# EAGLE schematic rgbsaber_periph1_v1.6 (EAGLE 5.10)
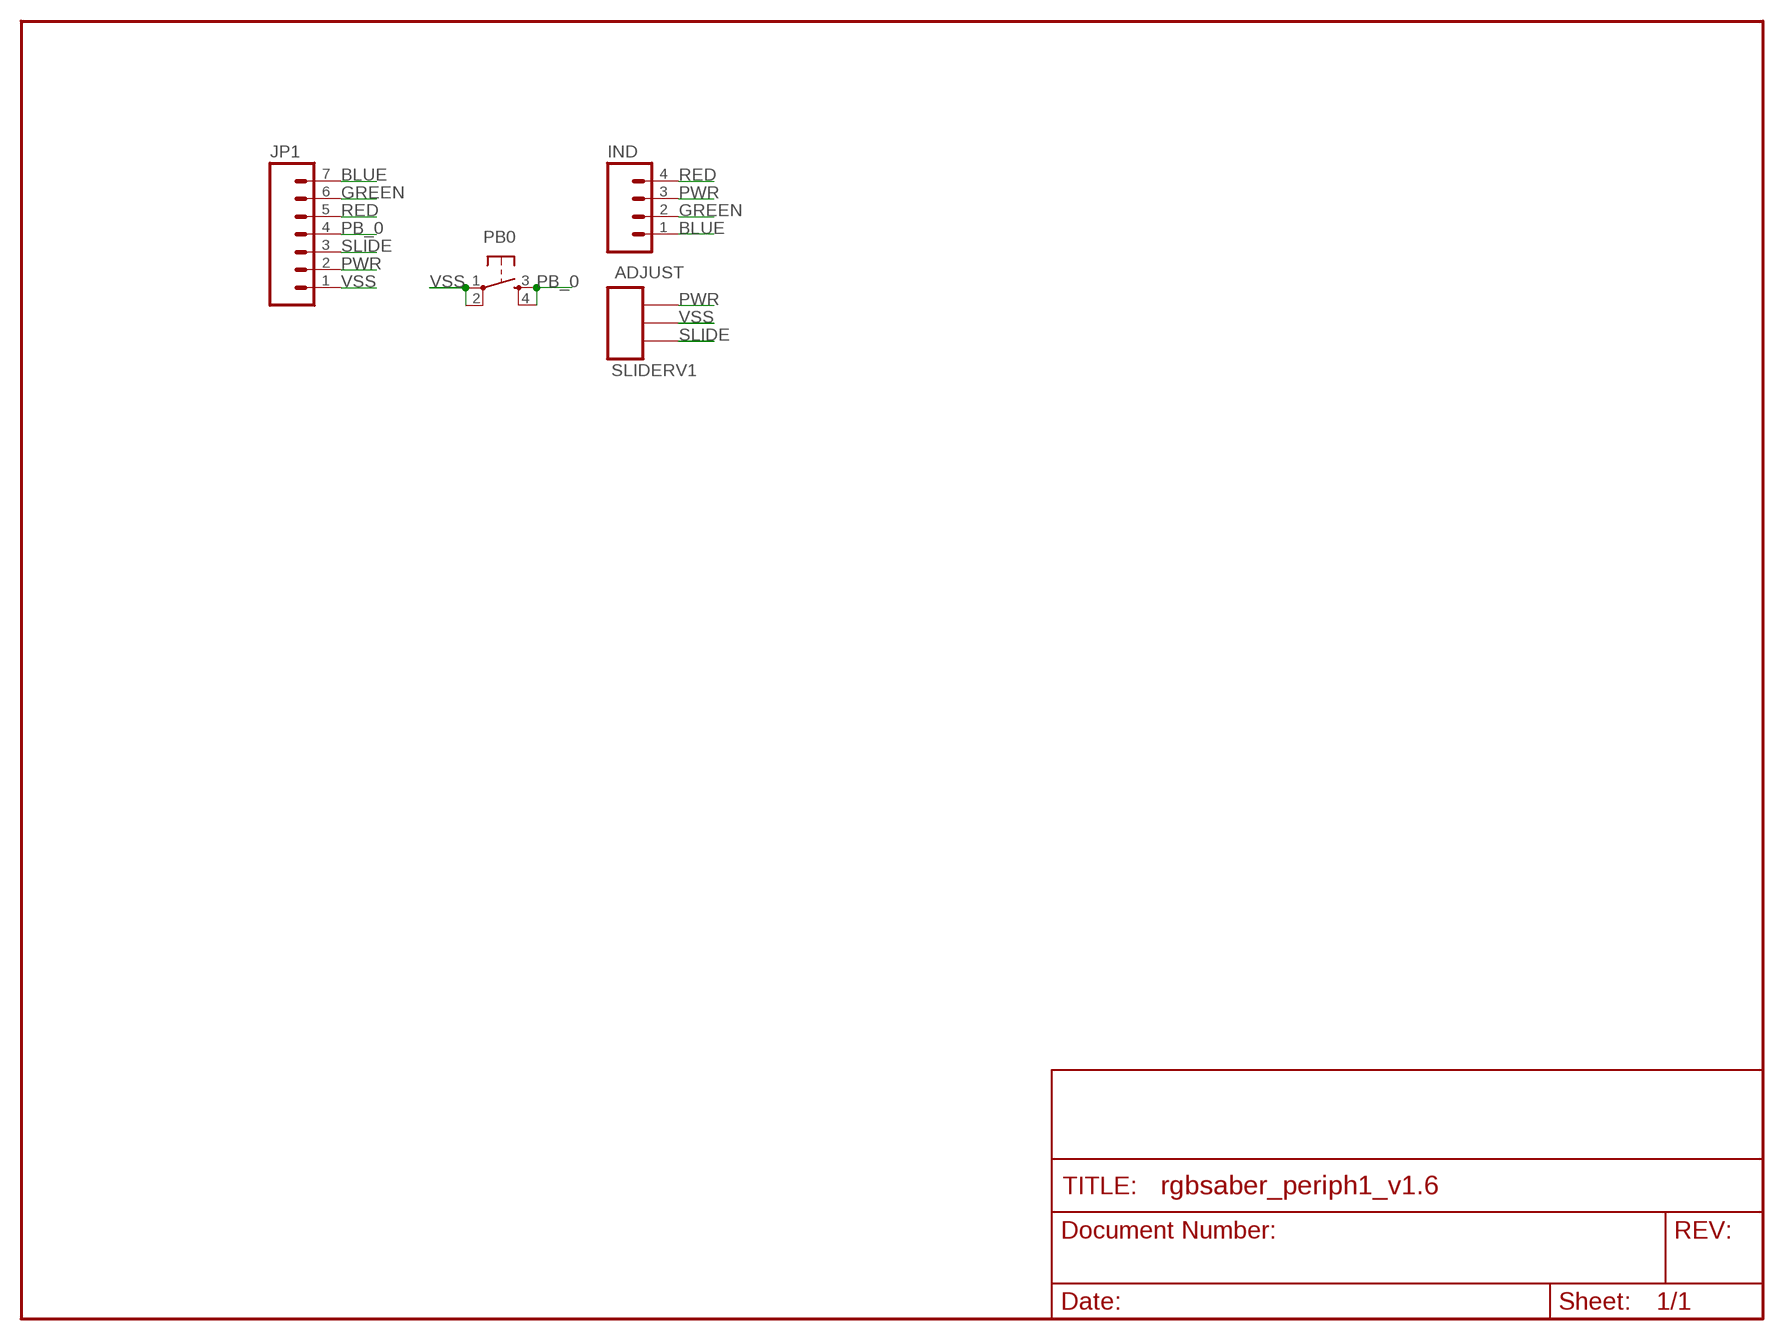
[diagram p0: schematic, sheet 1]

## Parts
ADJUST  SLIDERV1  [SLIDER-CUSTOM]
IND  M04PTH  [1X04]
JP1  M07  [1X07]
PB0  TAC_SWITCHPTH  [TACTILE-PTH]

## Nets
BLUE: IND.1 JP1.7
GREEN: IND.2 JP1.6
PB_0: JP1.4 PB0.3 PB0.4
PWR: ADJUST.P$1 IND.3 JP1.2
RED: IND.4 JP1.5
SLIDE: ADJUST.P$3 JP1.3
VSS: ADJUST.P$2 JP1.1 PB0.1 PB0.2

## Library data of the parts
ADJUST = purduecer:SLIDER: Sliding Potentiometer
IND = SparkFun:M04: Header 4 Standard 4-pin 0.1" header. Use with straight break away headers (SKU : PRT-00116), right angle break away headers (PRT-00553), swiss pins (PRT-00743), machine pins (PRT-00117), and female headers (PRT-00115). Molex polarized connector foot print use with SKU : PRT-08231 with associated crimp pins and housings.
JP1 = SparkFun:M07: Header 7 Standard 7-pin 0.1" header. Use with straight break away headers (SKU : PRT-00116), right angle break away headers (PRT-00553), swiss pins (PRT-00743), machine pins (PRT-00117), and female headers (PRT-00115). NOTES ON THE VARIANTS LOCK and LOCK_LONGPADS... This footprint was designed to help hold the alignment of a through-hole component (i.e. 7-pin header) while soldering it into place. You may notice that each hole has been shifted either up or down by 0.005 of an inch from it's more standard position (which is usually a perfectly straight line). This slight alteration caused the pins (the squares in the middle) to touch the edges of the holes. Because they are alternating, it causes a "brace" to hold the header in place. 0.005 has proven to be the perfect amount of "off-center" position when using our standard breakaway headers. Although looks a little odd when you look at the bare footprint, once you have a header in there, the alteration is very hard to notice. Also, if you push a header all the way into place, it is covered up entirely on the bottom side. This idea of altering the position of holes to aid alignment will be further integrated into the Sparkfun Library for other footprints. It can help hold any component with 3 or more connection pins.
PB0 = SparkFun:TAC_SWITCH: Momentary Switch Button commonly used for reset or general input. Spark Fun Electronics SKU : COM-00097